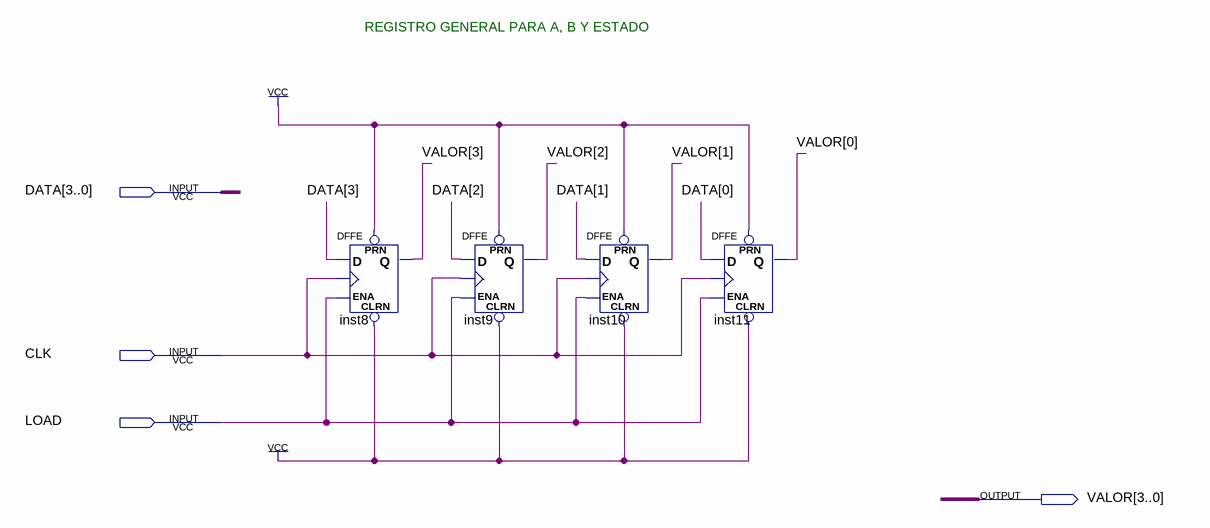
[diagram p0: schematic sheet]
// Quartus schematic Registro4Bits.bdf as structural Verilog: 4 symbols, 4 pins
module Registro4Bits (
  input  [3:0] DATA,
  input  CLK,
  input  LOAD,
  output [3:0] VALOR
);

  DFFE inst8 (.PRN(1'b1), .CLRN(1'b1), .D(DATA[3]), .CLK(CLK), .ENA(LOAD), .Q(VALOR[3]));
  DFFE inst9 (.PRN(1'b1), .CLRN(1'b1), .D(DATA[2]), .CLK(CLK), .ENA(LOAD), .Q(VALOR[2]));
  DFFE inst10 (.PRN(1'b1), .CLRN(1'b1), .D(DATA[1]), .CLK(CLK), .ENA(LOAD), .Q(VALOR[1]));
  DFFE inst11 (.PRN(1'b1), .CLRN(1'b1), .D(DATA[0]), .CLK(CLK), .ENA(LOAD), .Q(VALOR[0]));

  // Notes on the sheet:
  //   REGISTRO GENERAL PARA A, B Y ESTADO
endmodule
